# Altium schematic sheet ChannelMixer.SCHDOC
size B; Organization: Altium Limited; Address1: L3, 12a Rodborough Rd; Address2: Frenchs Forest; Address3: NSW; Address4: Australia 2086; DocumentNumber: 8; SheetNumber: 8; SheetTotal: 9
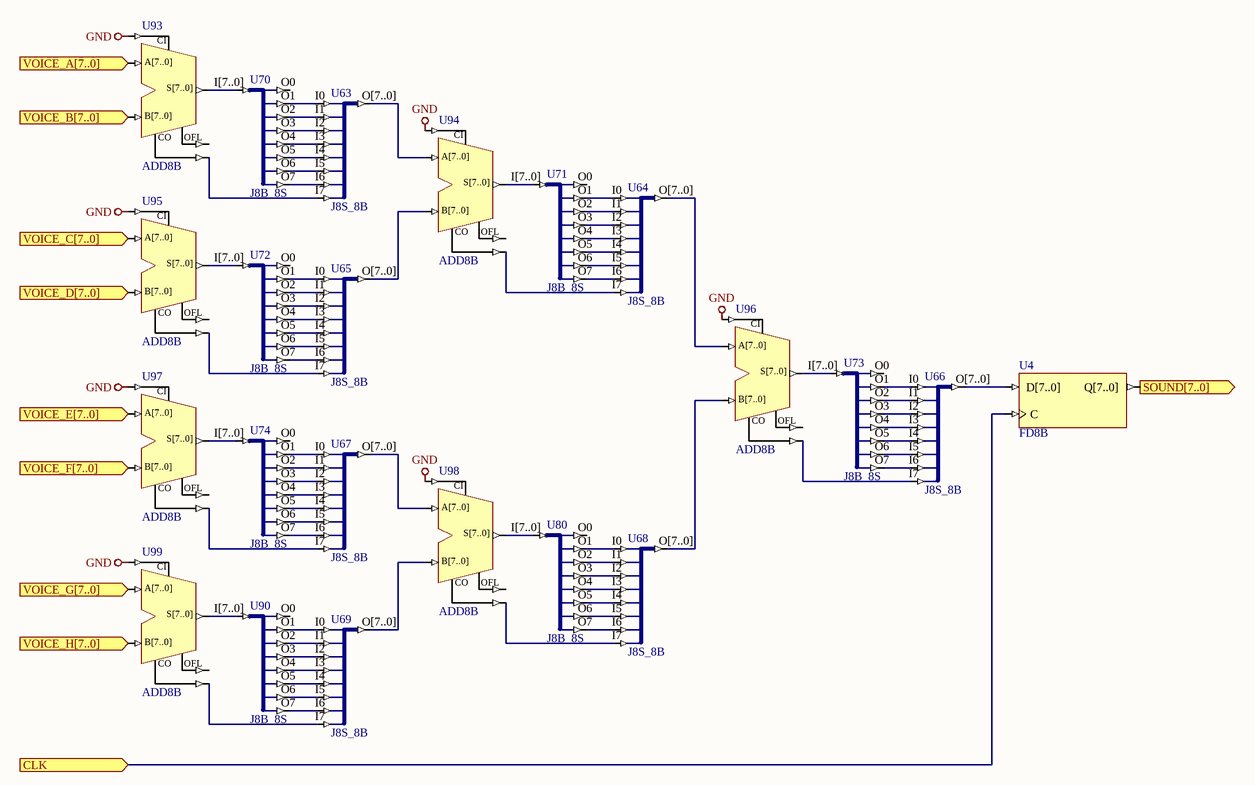
[diagram p0: ChannelMixer.SCHDOC]

## Parts
U4  FD8B
U63  J8S_8B
U64  J8S_8B
U65  J8S_8B
U66  J8S_8B
U67  J8S_8B
U68  J8S_8B
U69  J8S_8B
U70  J8B_8S
U71  J8B_8S
U72  J8B_8S
U73  J8B_8S
U74  J8B_8S
U80  J8B_8S
U90  J8B_8S
U93  ADD8B
U94  ADD8B
U95  ADD8B
U96  ADD8B
U97  ADD8B
U98  ADD8B
U99  ADD8B

## Ports
CLK (in), SOUND[7..0] (out), VOICE_A[7..0] (in), VOICE_B[7..0] (in), VOICE_C[7..0] (in), VOICE_D[7..0] (in), VOICE_E[7..0] (in), VOICE_F[7..0] (in), VOICE_G[7..0] (in), VOICE_H[7..0] (in)

## Nets
GND: U93.CI U94.CI U95.CI U96.CI U97.CI U98.CI U99.CI
CLK: U4.C ; port CLK
SOUND[7..0]: U4.Q[7..0] ; port SOUND[7..0]
VOICE_A[7..0]: U93.A[7..0] ; port VOICE_A[7..0]
VOICE_B[7..0]: U93.B[7..0] ; port VOICE_B[7..0]
VOICE_C[7..0]: U95.A[7..0] ; port VOICE_C[7..0]
VOICE_D[7..0]: U95.B[7..0] ; port VOICE_D[7..0]
VOICE_E[7..0]: U97.A[7..0] ; port VOICE_E[7..0]
VOICE_F[7..0]: U97.B[7..0] ; port VOICE_F[7..0]
VOICE_G[7..0]: U99.A[7..0] ; port VOICE_G[7..0]
VOICE_H[7..0]: U99.B[7..0] ; port VOICE_H[7..0]
NetU4_D[7..0]: U4.D[7..0] U66.O[7..0]
NetU63_I0: U63.I0 U70.O1
NetU63_I1: U63.I1 U70.O2
NetU63_I2: U63.I2 U70.O3
NetU63_I3: U63.I3 U70.O4
NetU63_I4: U63.I4 U70.O5
NetU63_I5: U63.I5 U70.O6
NetU63_I6: U63.I6 U70.O7
NetU63_I7: U63.I7 U93.CO
NetU63_O[7..0]: U63.O[7..0] U94.A[7..0]
NetU64_I0: U64.I0 U71.O1
NetU64_I1: U64.I1 U71.O2
NetU64_I2: U64.I2 U71.O3
NetU64_I3: U64.I3 U71.O4
NetU64_I4: U64.I4 U71.O5
NetU64_I5: U64.I5 U71.O6
NetU64_I6: U64.I6 U71.O7
NetU64_I7: U64.I7 U94.CO
NetU64_O[7..0]: U64.O[7..0] U96.A[7..0]
NetU65_I0: U65.I0 U72.O1
NetU65_I1: U65.I1 U72.O2
NetU65_I2: U65.I2 U72.O3
NetU65_I3: U65.I3 U72.O4
NetU65_I4: U65.I4 U72.O5
NetU65_I5: U65.I5 U72.O6
NetU65_I6: U65.I6 U72.O7
NetU65_I7: U65.I7 U95.CO
NetU65_O[7..0]: U65.O[7..0] U94.B[7..0]
NetU66_I0: U66.I0 U73.O1
NetU66_I1: U66.I1 U73.O2
NetU66_I2: U66.I2 U73.O3
NetU66_I3: U66.I3 U73.O4
NetU66_I4: U66.I4 U73.O5
NetU66_I5: U66.I5 U73.O6
NetU66_I6: U66.I6 U73.O7
NetU66_I7: U66.I7 U96.CO
NetU67_I0: U67.I0 U74.O1
NetU67_I1: U67.I1 U74.O2
NetU67_I2: U67.I2 U74.O3
NetU67_I3: U67.I3 U74.O4
NetU67_I4: U67.I4 U74.O5
NetU67_I5: U67.I5 U74.O6
NetU67_I6: U67.I6 U74.O7
NetU67_I7: U67.I7 U97.CO
NetU67_O[7..0]: U67.O[7..0] U98.A[7..0]
NetU68_I0: U68.I0 U80.O1
NetU68_I1: U68.I1 U80.O2
NetU68_I2: U68.I2 U80.O3
NetU68_I3: U68.I3 U80.O4
NetU68_I4: U68.I4 U80.O5
NetU68_I5: U68.I5 U80.O6
NetU68_I6: U68.I6 U80.O7
NetU68_I7: U68.I7 U98.CO
NetU68_O[7..0]: U68.O[7..0] U96.B[7..0]
NetU69_I0: U69.I0 U90.O1
NetU69_I1: U69.I1 U90.O2
NetU69_I2: U69.I2 U90.O3
NetU69_I3: U69.I3 U90.O4
NetU69_I4: U69.I4 U90.O5
NetU69_I5: U69.I5 U90.O6
NetU69_I6: U69.I6 U90.O7
NetU69_I7: U69.I7 U99.CO
NetU69_O[7..0]: U69.O[7..0] U98.B[7..0]
NetU70_I[7..0]: U70.I[7..0] U93.S[7..0]
NetU71_I[7..0]: U71.I[7..0] U94.S[7..0]
NetU72_I[7..0]: U72.I[7..0] U95.S[7..0]
NetU73_I[7..0]: U73.I[7..0] U96.S[7..0]
NetU74_I[7..0]: U74.I[7..0] U97.S[7..0]
NetU80_I[7..0]: U80.I[7..0] U98.S[7..0]
NetU90_I[7..0]: U90.I[7..0] U99.S[7..0]

Not connected (* = marked no-connect by the designer): U70 O0; U71 O0; U72 O0; U73 O0; U74 O0; U80 O0; U90 O0; U93 OFL; U94 OFL; U95 OFL; U96 OFL; U97 OFL; U98 OFL; U99 OFL

## Notes on the sheet
- Title
- Size:
- Date:
- B
- Number:
- Time:
- Revision:
- Sheet
- of
- File:

## Library data of the parts
U4 = FD8B: 8-Bit D-Type Flip-Flop, Bus Version; Xilinx Equivalent: FD8; ArchiveName: GENERIC; VHDLIB_SIM: GENERIC_LIB; Published: 29-Jan-2004; Publisher: Altium Limited; Core Revision: 1.00.00
U63-U69 = J8S_8B: 8 Single pin inputs to single 8-Bit output bus; ArchiveName: GENERIC; Published: 18-Dec-2003; Publisher: Altium Limited; Core Revision: 1.00.00
U70-U74 U80 U90 = J8B_8S: 8-Bit input bus to 8 single pin outputs; ArchiveName: GENERIC; Published: 18-Dec-2003; Publisher: Altium Limited; Core Revision: 1.00.00
U93-U99 = ADD8B: 8-Bit Cascadable Full Adder with Signed and Unsigned Operations, Bus Version; Xilinx Equivalent: ADD8; ArchiveName: GENERIC; Published: 18-Dec-2003; Publisher: Altium Limited; Core Revision: 1.00.00